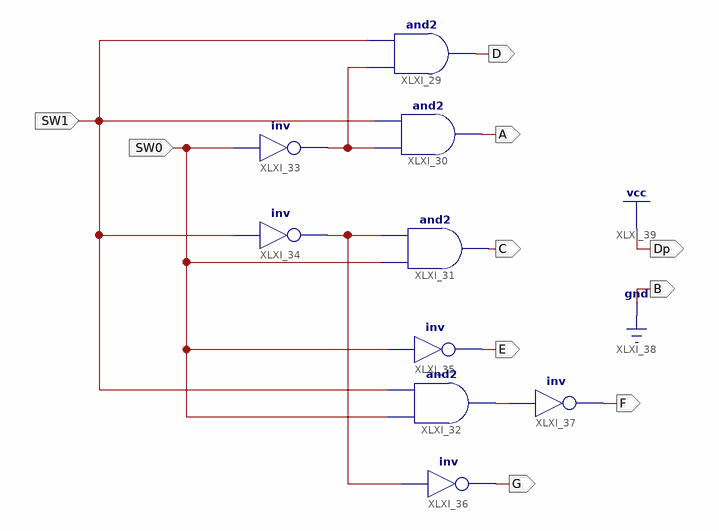
[diagram p0: schematic sheet 1]
// Xilinx ISE schematic SW_7SEG.sch (spartan6) as structural Verilog: 9 symbols, 10 ports
module SW_7SEG (
  input  SW1,
  input  SW0,
  output D,
  output A,
  output C,
  output E,
  output F,
  output G,
  output Dp,
  output B
);

  wire XLXN_46, XLXN_48, XLXN_52;

  and XLXI_29 (D, XLXN_48, SW1);
  and XLXI_30 (A, XLXN_48, SW1);
  and XLXI_31 (C, SW0, XLXN_52);
  and XLXI_32 (XLXN_46, SW0, SW1);
  not XLXI_33 (XLXN_48, SW0);
  not XLXI_34 (XLXN_52, SW1);
  not XLXI_35 (E, SW0);
  not XLXI_36 (G, XLXN_52);
  not XLXI_37 (F, XLXN_46);

  assign B = 1'b0;
  assign Dp = 1'b1;
endmodule
